# EAGLE schematic Arduinomini (EAGLE 8.6.0)
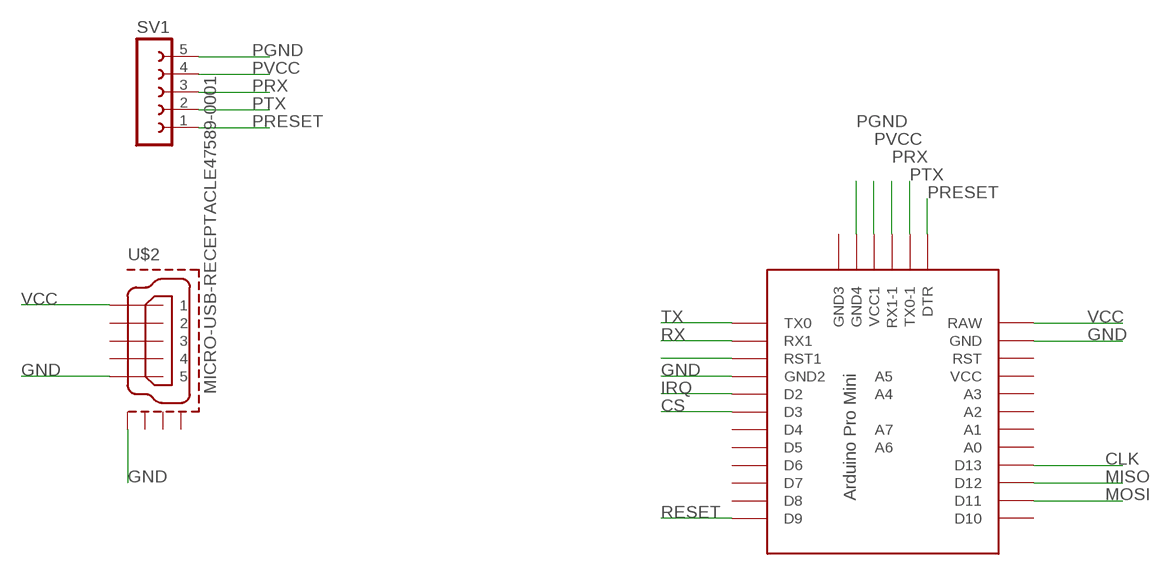
[diagram p0: schematic, sheet 1]

## Parts
SV1  FE05-1  [FE05-1]
U$1  PRO-MINI-2  [PRO-MINI-2]
U$2  MICRO-USB-RECEPTACLE47589-0001  [47589-0001]

## Nets
CLK: U$1.D13
CS: U$1.D3
GND: U$1.GND U$1.GND1(GND2) U$2.5 U$2.CASING1(GND1)
IRQ: U$1.D2
MISO: U$1.D12
MOSI: U$1.D11
N$3: U$1.RST1
PGND: SV1.5 U$1.GND3(GND4)
PRESET: SV1.1 U$1.DTR
PRX: SV1.3 U$1.RX1-1
PTX: SV1.2 U$1.TX0-1
PVCC: SV1.4 U$1.VCC1
RESET: U$1.D9
RX: U$1.RX1
TX: U$1.TX0
VCC: U$1.RAW U$2.1
Unconnected: U$1.A0 U$1.A1 U$1.A2 U$1.A3 U$1.A4 U$1.A5 U$1.A6 U$1.A7 U$1.D4 U$1.D5 U$1.D6 U$1.D7 U$1.D8 U$1.D10 U$1.GND2(GND3) U$1.RST U$1.VCC U$2.2 U$2.3 U$2.4 U$2.CASING2(GND2) U$2.CASING3(GND3) U$2.CASING4(GND4)

## Library data of the parts
SV1 = con-lsta:FE05-1: FEMALE HEADER; OC_FARNELL: unknown; OC_NEWARK: unknown
U$1 = Arduino-clone:PRO-MINI-2: Arduino Pro Mini Layout 2 Sparkfun.com
U$2 = con-molex-usb:MICRO-USB-RECEPTACLE: MICRO USB RECEPTACLES Micro-USB Receptacles, SMT, Lead-Free from MOLEX <http://www.molex.com/>. (C) 2014 Tomasz Boleslaw CEDRO, cederom@tlen.pl, http://www.tomek.cedro.info. Version 0.1 (2014-01-17): Initial release. Version 0.2 (2014-02-06): Updated 47589-0001 footprint pins/pads/milling. Following devices are included: 1. 47589-0001 Micro-USB AB Receptacle, Bottom Mount, SMT, Lead-Free <http://www.molex.com/molex/products/datasheet.jsp?part=active/0475890001_IO_CONNECTORS.xml> (Technical Drawing <http://www.molex.com/pdm_docs/sd/475890001_sd.pdf>).